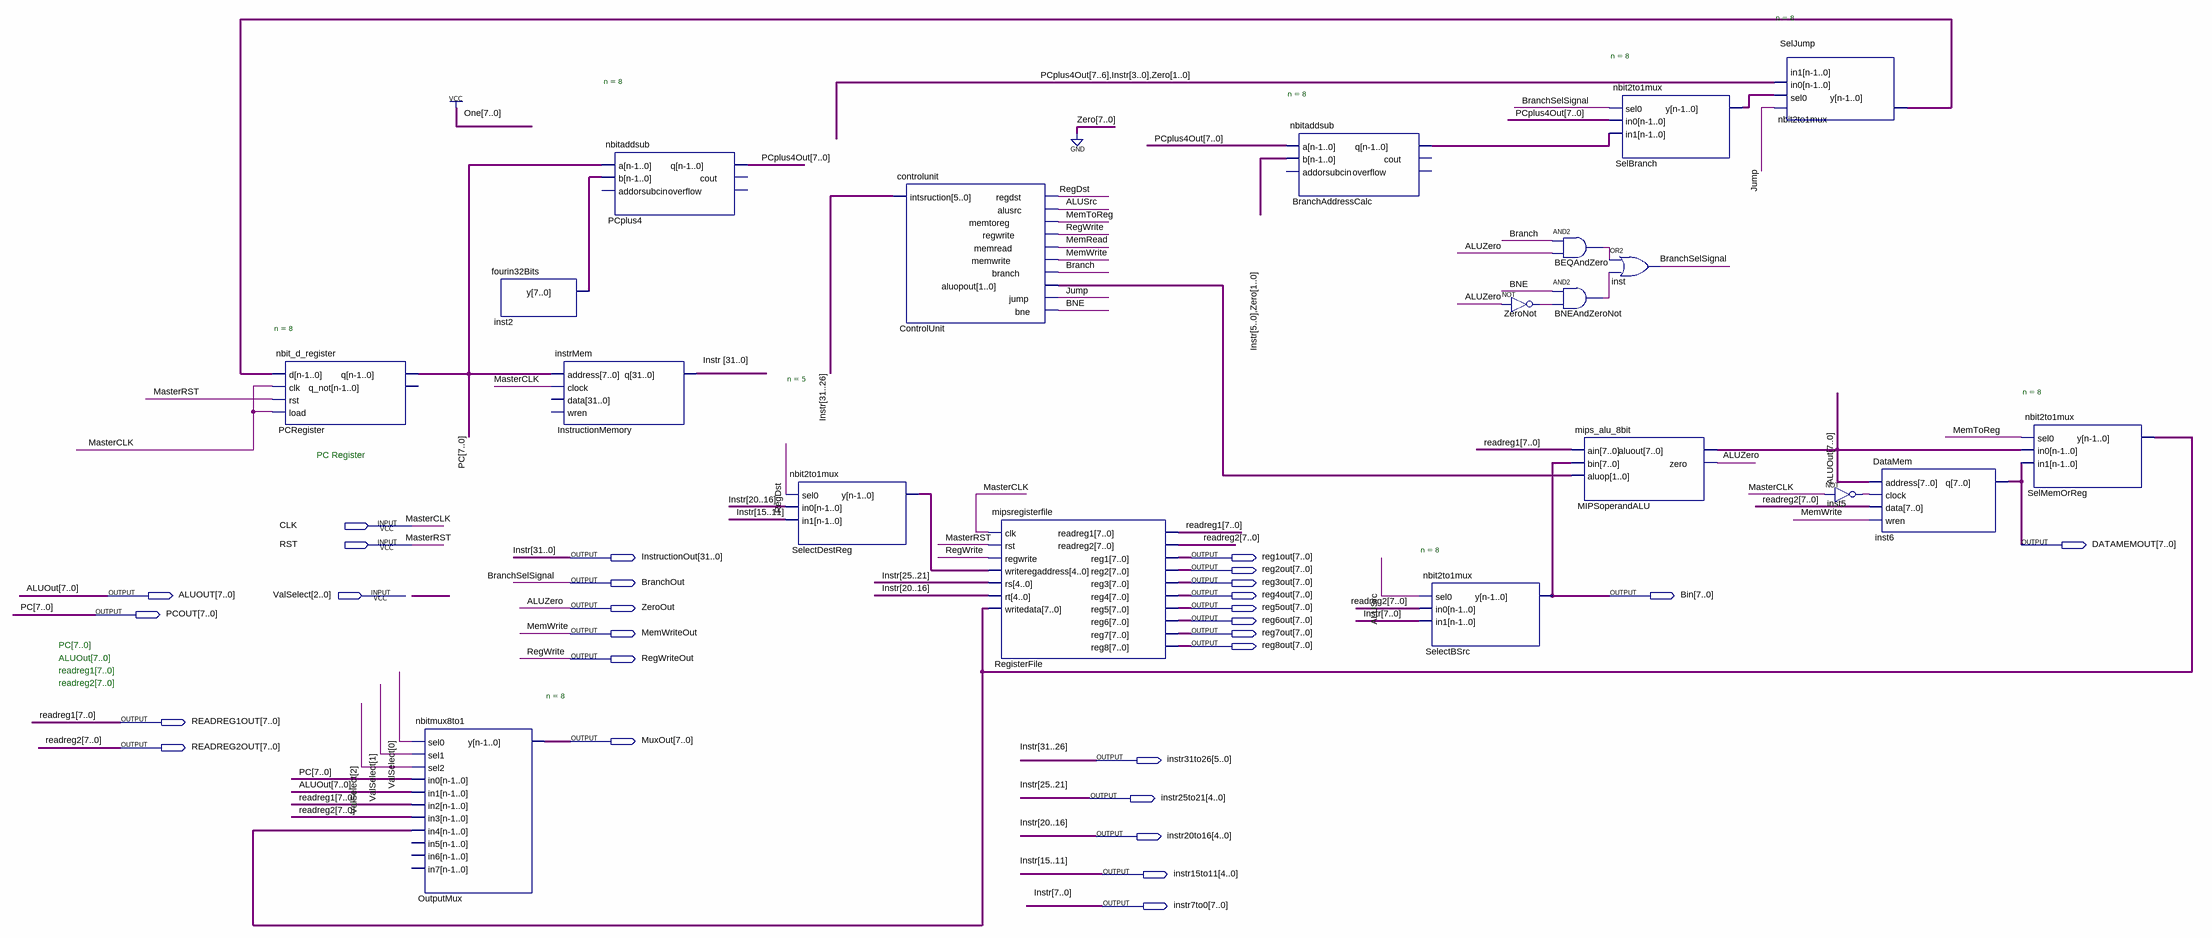
[diagram p0: schematic sheet]
// Quartus schematic TopLevelEntity.bdf as structural Verilog: 20 symbols, 28 pins
module TopLevelEntity (
  input  CLK,
  input  RST,
  input  [2:0] ValSelect,
  output [7:0] DATAMEMOUT,
  output [31:0] InstructionOut,
  output [7:0] reg1out,
  output [7:0] reg2out,
  output BranchOut,
  output [7:0] reg3out,
  output [7:0] ALUOUT,
  output [7:0] reg4out,
  output [7:0] Bin,
  output ZeroOut,
  output [7:0] reg5out,
  output [7:0] PCOUT,
  output [7:0] reg6out,
  output MemWriteOut,
  output [7:0] reg7out,
  output [7:0] reg8out,
  output RegWriteOut,
  output [7:0] READREG1OUT,
  output [7:0] MuxOut,
  output [7:0] READREG2OUT,
  output [5:0] instr31to26,
  output [4:0] instr25to21,
  output [4:0] instr20to16,
  output [4:0] instr15to11,
  output [7:0] instr7to0
);

  wire ALUSrc, BEQAndZero_out, BNE, BNEAndZeroNot_out, Branch, inst5_out, Jump, MemRead, MemToReg, RegDst,
       ZeroNot_out;
  wire [1:0] ControlUnit_aluopout;
  wire [4:0] SelectDestReg_y;
  wire [7:0] BranchAddressCalc_q, inst2_y, PCplus4Out, SelBranch_y, SelJump_y, SelMemOrReg_y;

  nbit_d_register #(.n(8)) PCRegister (.d(SelJump_y), .clk(CLK), .rst(RST), .load(CLK), .q(PCOUT));  // open: q_not
  nbitmux8to1 #(.n(8)) OutputMux (
    .sel0(ValSelect[0]), .sel1(ValSelect[1]), .sel2(ValSelect[2]), .in0(PCOUT), .in1(ALUOUT),
    .in2(READREG1OUT), .in3(READREG2OUT), .in4(SelMemOrReg_y), .y(MuxOut));  // open: in5, in6, in7
  fourin32Bits inst2 (.y(inst2_y));
  instrMem InstructionMemory (
    .address(PCOUT), .clock(CLK),
    .q({instr31to26, instr25to21, instr20to16, instr15to11, InstructionOut[10:8], instr7to0}));  // open: data, wren
  nbitaddsub #(.n(8)) PCplus4 (.a(PCOUT), .b(inst2_y), .q(PCplus4Out));  // open: addorsubcin, cout, overflow
  nbit2to1mux #(.n(5)) SelectDestReg (.sel0(RegDst), .in0(instr20to16), .in1(instr15to11), .y(SelectDestReg_y));
  controlunit ControlUnit (
    .intsruction(instr31to26), .regdst(RegDst), .alusrc(ALUSrc), .memtoreg(MemToReg), .regwrite(RegWriteOut),
    .memread(MemRead), .memwrite(MemWriteOut), .branch(Branch), .aluopout(ControlUnit_aluopout), .jump(Jump),
    .bne(BNE));
  mipsregisterfile RegisterFile (
    .clk(CLK), .rst(RST), .regwrite(RegWriteOut), .writeregaddress(SelectDestReg_y), .rs(instr25to21),
    .rt(instr20to16), .writedata(SelMemOrReg_y), .readreg1(READREG1OUT), .readreg2(READREG2OUT),
    .reg1(reg1out), .reg2(reg2out), .reg3(reg3out), .reg4(reg4out), .reg5(reg5out), .reg6(reg6out),
    .reg7(reg7out), .reg8(reg8out));
  nbitaddsub #(.n(8)) BranchAddressCalc (
    .a(PCplus4Out), .b({instr7to0[5:0], 2'b00}), .q(BranchAddressCalc_q));  // open: addorsubcin, cout, overflow
  nbit2to1mux #(.n(8)) SelectBSrc (.sel0(ALUSrc), .in0(READREG2OUT), .in1(instr7to0), .y(Bin));
  not ZeroNot (ZeroNot_out, ZeroOut);
  and BEQAndZero (BEQAndZero_out, Branch, ZeroOut);
  and BNEAndZeroNot (BNEAndZeroNot_out, BNE, ZeroNot_out);
  mips_alu_8bit MIPSoperandALU (
    .ain(READREG1OUT), .bin(Bin), .aluop(ControlUnit_aluopout), .aluout(ALUOUT), .zero(ZeroOut));
  nbit2to1mux #(.n(8)) SelBranch (.sel0(BranchOut), .in0(PCplus4Out), .in1(BranchAddressCalc_q), .y(SelBranch_y));
  or inst (BranchOut, BEQAndZero_out, BNEAndZeroNot_out);
  nbit2to1mux #(.n(8)) SelJump (
    .sel0(Jump), .in0(SelBranch_y), .in1({PCplus4Out[7:6], instr7to0[3:0], 2'b00}), .y(SelJump_y));
  not inst5 (inst5_out, CLK);
  DataMem inst6 (.address(ALUOUT), .clock(inst5_out), .data(READREG2OUT), .wren(MemWriteOut), .q(DATAMEMOUT));
  nbit2to1mux #(.n(8)) SelMemOrReg (.sel0(MemToReg), .in0(ALUOUT), .in1(DATAMEMOUT), .y(SelMemOrReg_y));

  assign {InstructionOut[31:11], InstructionOut[7:0]} = {instr31to26, instr25to21, instr20to16, instr15to11, instr7to0};

  // Other names for the same wires on the sheet: ALUZero = ZeroOut; BranchSelSignal = BranchOut;
  //   Instr[31:0] = {instr31to26, instr25to21, instr20to16, instr15to11, InstructionOut[10:8], instr7to0};
  //   MasterCLK = CLK; MasterRST = RST; MemWrite = MemWriteOut; PC[7:0] = PCOUT; readreg1[7:0] = READREG1OUT;
  //   readreg2[7:0] = READREG2OUT; RegWrite = RegWriteOut

  // Notes on the sheet:
  //   PC Register
  //   PC[7..0]
  //   ALUOut[7..0]
  //   readreg1[7..0]
  //   readreg2[7..0]
endmodule
